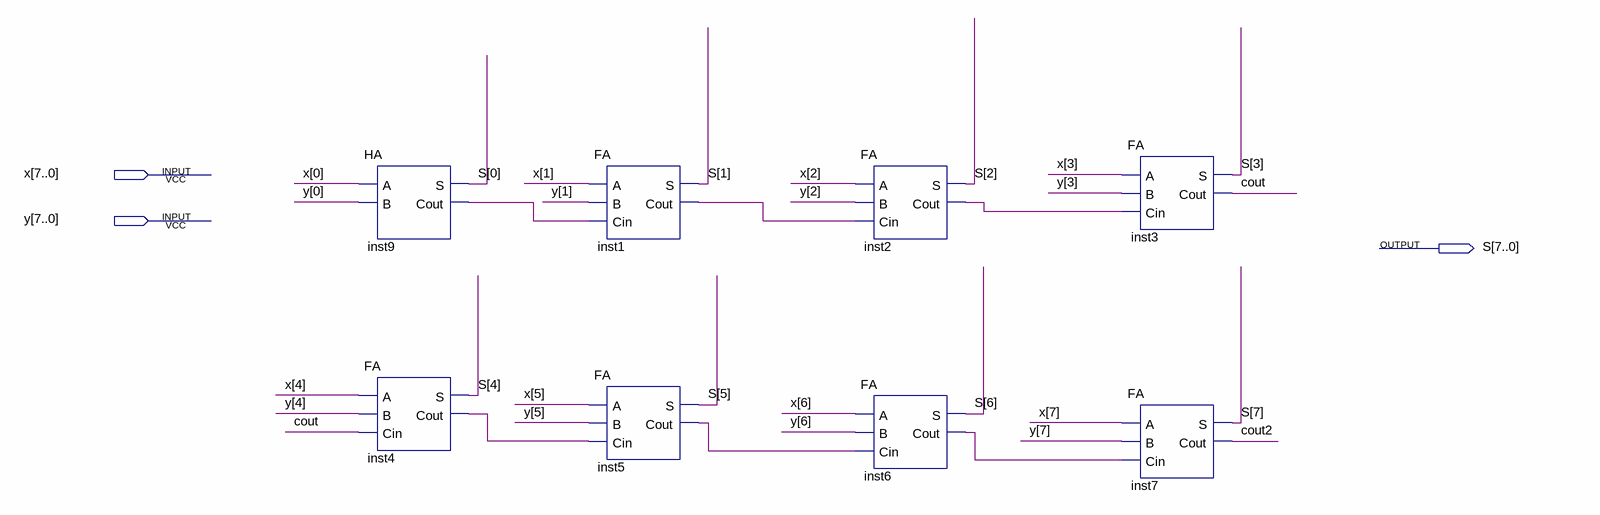
[diagram p0: schematic sheet]
// Quartus schematic SOMADOR.bdf as structural Verilog: 8 symbols, 3 pins
module SOMADOR (
  input  [7:0] x,
  input  [7:0] y,
  output [7:0] S
);

  wire cout, cout2, inst1_cout, inst2_cout, inst4_cout, inst5_cout, inst6_cout, inst9_cout;

  HA inst9 (.A(x[0]), .B(y[0]), .S(S[0]), .Cout(inst9_cout));
  FA inst4 (.A(x[4]), .B(y[4]), .Cin(cout), .S(S[4]), .Cout(inst4_cout));
  FA inst1 (.A(x[1]), .B(y[1]), .Cin(inst9_cout), .S(S[1]), .Cout(inst1_cout));
  FA inst5 (.A(x[5]), .B(y[5]), .Cin(inst4_cout), .S(S[5]), .Cout(inst5_cout));
  FA inst2 (.A(x[2]), .B(y[2]), .Cin(inst1_cout), .S(S[2]), .Cout(inst2_cout));
  FA inst6 (.A(x[6]), .B(y[6]), .Cin(inst5_cout), .S(S[6]), .Cout(inst6_cout));
  FA inst3 (.A(x[3]), .B(y[3]), .Cin(inst2_cout), .S(S[3]), .Cout(cout));
  FA inst7 (.A(x[7]), .B(y[7]), .Cin(inst6_cout), .S(S[7]), .Cout(cout2));
endmodule
